# Altium project GPS-Board.PrjPcb
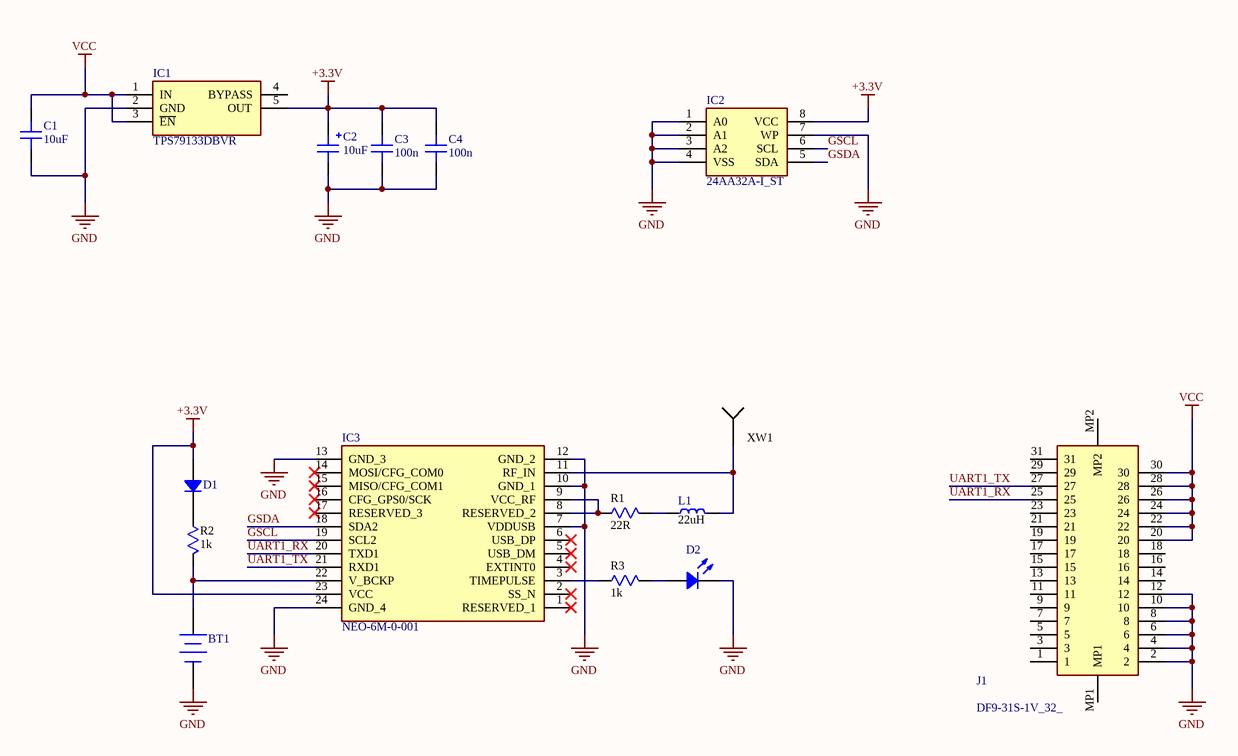
[diagram p0: GPS-Board.SchDoc]
1 sheet, 16 parts. Net scope: global (net labels, ports and power ports of the same name join across sheets).
Board file: GPS-Board.PcbDoc

## Sheet GPS-Board.SchDoc
size A4; SheetNumber: 1; SheetTotal: 1

### Parts
BT1  MS621FE-FL11E  [SEIK-MS621FE-FL11E-2_V]  (value not drawn)
C1  10uF  [CAP: 0805]
C2  10uF  [CAP: TANTAL-A]
C3  100n  [CAP: 0603]
C4  100n  [CAP: 0603]
D1  (no value)  [DIODE: SOD323]
D2  (no value)  [LED0805]
IC1  TPS79133DBVR  [SOT95P280X145-5N]
IC2  24AA32A-I_ST  [SOP65P640X120-8N]
IC3  NEO-6M-0-001  [NEO6M0001]
J1  DF9-31S-1V_32_  [DF931S1V32]
L1  22uH  [IND: 0805]
R1  value 22R  [RES: 0603]
R2  value 1k  [RES: 0603]
R3  value 1k  [RES: 0603]
XW1  (no value)  [ANT: PCB]

### Nets
+3.3V: C2.1 C3.2 C4.2 D1.1 IC1.5(OUT) IC2.8(VCC) IC3.23(VCC)
GND: BT1.2(-) C1.1 C2.2 C3.1 C4.1 D2.2 IC1.2(GND) IC2.1(A0) IC2.2(A1) IC2.3(A2) IC2.4(VSS) IC2.7(WP) IC3.7(VDDUSB) IC3.10(GND_1) IC3.12(GND_2) IC3.13(GND_3) IC3.24(GND_4) J1.2 J1.4 J1.6 J1.8 J1.10 J1.12
VCC: C1.2 IC1.1(IN) IC1.3(~{EN}) J1.20 J1.22 J1.24 J1.26 J1.28 J1.30
GSCL: IC2.6(SCL) IC3.19(SCL2)
GSDA: IC2.5(SDA) IC3.18(SDA2)
UART1_RX: IC3.20(TXD1) J1.25
UART1_TX: IC3.21(RXD1) J1.27
NetBT1_1: BT1.1(+) IC3.22(V_BCKP) R2.2
NetD1_2: D1.2 R2.1
NetD2_1: D2.1 R3.2
NetIC3_3: IC3.3(TIMEPULSE) R3.1
NetIC3_8: IC3.8(RESERVED_2) IC3.9(VCC_RF) R1.1
NetIC3_11: IC3.11(RF_IN) L1.2 XW1.1(SIG)
NetL1_1: L1.1 R1.2

Not connected (* = marked no-connect by the designer): IC1 4(BYPASS); IC3 1(RESERVED_1)* 2(SS_N)* 4(EXTINT0)* 5(USB_DM)* 6(USB_DP)* 14(MOSI/CFG_COM0)* 15(MISO/CFG_COM1)* 16(CFG_GPS0/SCK)* 17(RESERVED_3)*; J1 1 3 5 7 9 11 13 14 15 16 17 18 19 21 23 29 31 MP1 MP2

### Library data of the parts
BT1 = CMP-2000-05342-1: MS Lihium Rechargeable Battery, 3 V, -20 to 60 degC, Tray; Manufacturer: SeikoInstruments; Brand: SeikoInstrumentsMicroEnergy; Output Voltage: 3V; Capacity: 5.5mAh; Chemistry: Lithium; Battery Size: 621; Unit Weight: 0.008113oz; Datasheet URL: http://datasheet.octopart.com/MS621FE-FL11E-Seiko-datasheet-5320152.pdf; Rechargeable/Non-Rechargeable: Rechargeable; Orientation: Vertical; Height: 2.1mm; Series: MS; Datasheet Version: Jan-08; Type: CoinCellBatterywithLeads; Diameter: 6.8mm; Mounting Style: WithLeads; Product Category: CoinCellBattery; Termination Style: ThroughHole; Packaging: Tray; Manufacturer URL: http://www.sii.co.jp/en/; RoHS: NotApplicable; Factory Pack Quantity: 100
C1 C3 C4 = Capacitor: SMD Capacitor
C2 = Capacitor_polar: SMD Capacitor Polar
D1 = Diode: Rectifier Diode
D2 = LED: Chip LED
IC1 = TPS79133DBVR: Integrated Circuit; Manufacturer_Name: Texas Instruments; Datasheet Link: https://datasheet.lcsc.com/szlcsc/Texas-Instruments-TI-TPS79133DBVR_C9838.pdf; Height: 1.45mm; Manufacturer_Part_Number: TPS79133DBVR; Mouser Part Number: 595-TPS79133DBVR; Mouser Price/Stock: https://www.mouser.co.uk/ProductDetail/Texas-Instruments/TPS79133DBVR?qs=tJ5HNKWh3OXEQKJOaYvX6A%3D%3D; Arrow Part Number: TPS79133DBVR; Arrow Price/Stock: https://www.arrow.com/en/products/tps79133dbvr/texas-instruments?region=nac
IC2 = 24AA32A-I_ST: Integrated Circuit; Manufacturer_Name: Microchip; Manufacturer_Part_Number: 24AA32A-I/ST; Datasheet Link: http://ww1.microchip.com/downloads/en/DeviceDoc/21713M.pdf; Height: 1.2mm; Mouser Part Number: 579-24AA32A-I/ST; Mouser Price/Stock: https://www.mouser.co.uk/ProductDetail/Microchip-Technology/24AA32A-I-ST/?qs=z30FE1aq6wbUu0ZQUmtPYw%3D%3D; Arrow Part Number: 24AA32A-I/ST; Arrow Price/Stock: https://www.arrow.com/en/products/24aa32a-ist/microchip-technology?region=nac
IC3 = NEO-6M-0-001: Integrated Circuit; Manufacturer_Name: U-Blox; Datasheet Link: https://www.u-blox.com/sites/default/files/products/documents/NEO-6_DataSheet_%28GPS.G6-HW-09005%29.pdf; Height: 2.6mm; Manufacturer_Part_Number: NEO-6M-0-001
J1 = DF9-31S-1V_32_: Connector; Manufacturer_Name: Hirose; Manufacturer_Part_Number: DF9-31S-1V(32); Datasheet Link: http://www.mouser.com/ds/2/185/DF9_catalog-939217.pdf; Height: 3.3mm; Mouser Part Number: 798-DF9-31S-1V32; Mouser Price/Stock: https://www.mouser.co.uk/ProductDetail/Hirose-Connector/DF9-31S-1V32?qs=zOgoZG1CgI88k8P2oY2QVw%3D%3D; Arrow Part Number: DF9-31S-1V(32); Arrow Price/Stock: https://www.arrow.com/en/products/df9-31s-1v-32/hirose-electric; System: Connector
L1 = IND_SMD: INDUCTOR, SMD; VALUE: 22uH
R1-R3 = Resistor: Manufacturer: Yageo; PartNumber: RC0201JR-07100RL; TypeResistor: Resistor film; Power: 0.05W; Package: 0201; HelpURL: https://www.digikey.com/product-detail/en/yageo/RC0201JR-07100RL/311-100NCT-ND/1949006; ValueManufacturerPartNumber: =TypeResistor+', '+Value+', '+Tolerance+', '+Package+', '+Power+', '+Temperature; Temperature: -55...+125°C
XW1 = Connector RF